# Altium schematic sheet simp_sensor_v1.SchDoc
size A4
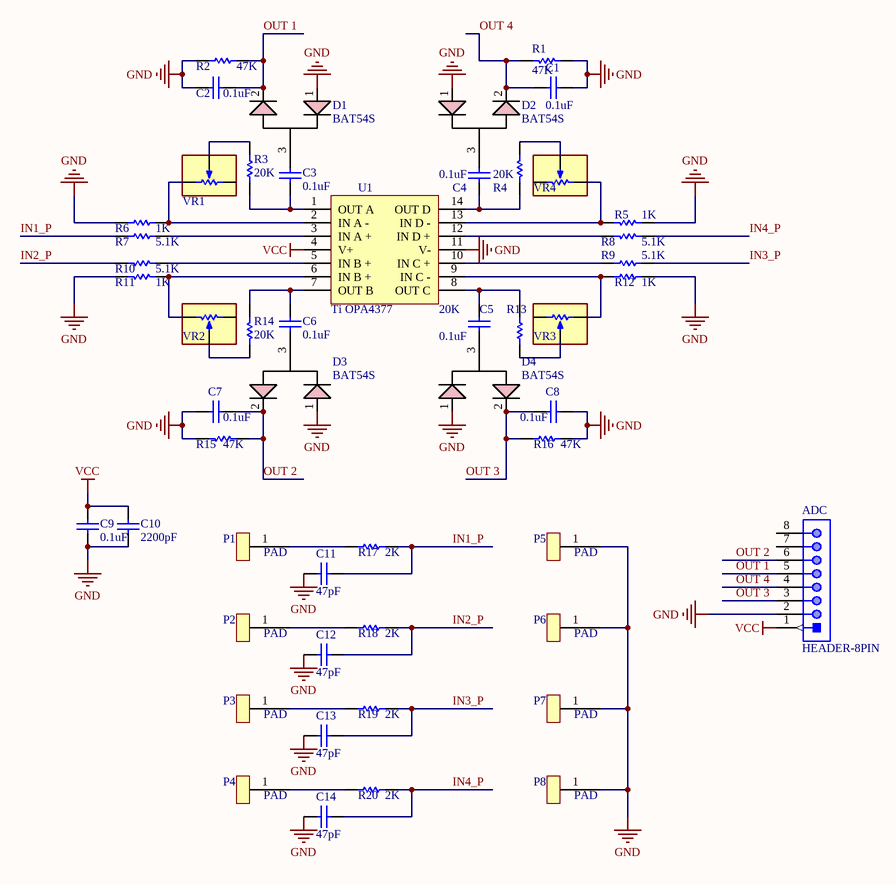
[diagram p0: simp_sensor_v1.SchDoc]

## Parts
ADC  HEADER-8PIN  [HEADER_8P_1.25_RT]
C1  0.1uF  [0603_C]
C2  0.1uF  [0603_C]
C3  0.1uF  [0603_C]
C4  0.1uF  [0603_C]
C5  0.1uF  [0603_C]
C6  0.1uF  [0603_C]
C7  0.1uF  [0603_C]
C8  0.1uF  [0603_C]
C9  0.1uF  [0603_C]
C10  2200pF  [0603_C]
C11  47pF  [0603_C]
C12  47pF  [0603_C]
C13  47pF  [0603_C]
C14  47pF  [0603_C]
D1  BAT54S  [SOT95P240X120-3N]
D2  BAT54S  [SOT95P240X120-3N]
D3  BAT54S  [SOT95P240X120-3N]
D4  BAT54S  [SOT95P240X120-3N]
P1  PAD  [PAD]
P2  PAD  [PAD]
P3  PAD  [PAD]
P4  PAD  [PAD]
P5  PAD  [PAD]
P6  PAD  [PAD]
P7  PAD  [PAD]
P8  PAD  [PAD]
R1  47K  [0603_R]
R2  47K  [0603_R]
R3  20K  [0603_R]
R4  20K  [0603_R]
R5  1K  [0603_R]
R6  1K  [0603_R]
R7  5.1K  [0603_R]
R8  5.1K  [0603_R]
R9  5.1K  [0603_R]
R10  5.1K  [0603_R]
R11  1K  [0603_R]
R12  1K  [0603_R]
R13  20K  [0603_R]
R14  20K  [0603_R]
R15  47K  [0603_R]
R16  47K  [0603_R]
R17  2K  [0603_R]
R18  2K  [0603_R]
R19  2K  [0603_R]
R20  2K  [0603_R]
U1  Ti OPA4377  [TSSOP14]
VR1  3224W-1-101G  [3224W1101G]  (value not drawn)
VR2  3224W-1-101G  [3224W1101G]  (value not drawn)
VR3  3224W-1-101G  [3224W1101G]  (value not drawn)
VR4  3224W-1-101G  [3224W1101G]  (value not drawn)

## Nets
GND: ADC.2 C1.2 C2.2 C7.2 C8.2 C9.1 C10.1 C11.1 C12.1 C13.1 C14.1 D1.1(A) D2.1(A) D3.1(A) D4.1(A) P5.1 P6.1 P7.1 P8.1 R1.1 R2.1 R5.1 R6.1 R11.1 R12.1 R15.1 R16.1 U1.11(V-)
VCC: ADC.1 C9.2 C10.2 U1.4(V+)
IN1_P: C11.2 R7.1 R17.1
IN2_P: C12.2 R10.1 R18.1
IN3_P: C13.2 R9.1 R19.1
IN4_P: C14.2 R8.1 R20.1
OUT 1: ADC.5 C2.1 D1.2(K) R2.2
OUT 2: ADC.6 C7.1 D3.2(K) R15.2
OUT 3: ADC.3 C8.1 D4.2(K) R16.2
OUT 4: ADC.4 C1.1 D2.2(K) R1.2
NetC3_1: C3.1 D1.3(A/K)
NetC3_2: C3.2 R3.2 U1.1(OUT_A)
NetC4_1: C4.1 D2.3(A/K)
NetC4_2: C4.2 R4.2 U1.14(OUT_D)
NetC5_1: C5.1 D4.3(A/K)
NetC5_2: C5.2 R13.2 U1.8(OUT_C)
NetC6_1: C6.1 D3.3(A/K)
NetC6_2: C6.2 R14.2 U1.7(OUT_B)
NetP1_1: P1.1 R17.2
NetP2_1: P2.1 R18.2
NetP3_1: P3.1 R19.2
NetP4_1: P4.1 R20.2
NetR3_1: R3.1 VR1.2(TAP)
NetR4_1: R4.1 VR4.2(TAP)
NetR5_2: R5.2 U1.13(IN_D_-) VR4.3(BOT)
NetR6_2: R6.2 U1.2(IN_A_-) VR1.3(BOT)
NetR7_2: R7.2 U1.3(IN_A_+)
NetR8_2: R8.2 U1.12(IN_D_+)
NetR9_2: R9.2 U1.10(IN_C_+)
NetR10_2: R10.2 U1.5(IN_B_+)
NetR11_2: R11.2 U1.6(IN_B_+) VR2.3(BOT)
NetR12_2: R12.2 U1.9(IN_C_-) VR3.3(BOT)
NetR13_1: R13.1 VR3.2(TAP)
NetR14_1: R14.1 VR2.2(TAP)

Not connected (* = marked no-connect by the designer): ADC 7 8; VR1 1(TOP); VR2 1(TOP); VR3 1(TOP); VR4 1(TOP)

## Library data of the parts
C1-C14 = CAP: Capacitor; Value: 104; Published: 8-Jun-2000; LatestRevisionDate: 17-Jul-2002; LatestRevisionNote: Re-released for DXP Platform.; PackageReference: RAD-0.3; Publisher: Altium Limited
D1-D4 = BAT54S: Schottky Diode; Manufacturer_Name: ON Semiconductor; Datasheet Link: http://www.onsemi.com/pub/Collateral/BAT54S-D.pdf; Height: 1.2mm; Manufacturer_Part_Number: BAT54S; Mouser Part Number: 512-BAT54S; Mouser Price/Stock: https://www.mouser.com/Search/Refine.aspx?Keyword=512-BAT54S; RS Part Number: 6708797P; RS Price/Stock: http://uk.rs-online.com/web/p/products/6708797P
R1-R4 R7-R10 R13-R20 = RES0: Resistor; Value: 1K; Published: 8-Jun-2000; Revision: July-2002: Re-released for DXP Platform.; Publisher: Altium Limited
R5 R6 R11 R12 = RES0: Resistor; Published: 8-Jun-2000; Revision: July-2002: Re-released for DXP Platform.; Publisher: Altium Limited; Value: 1K
U1 = opa4377
VR1-VR4 = 3224W-1-101G: Variable Resistor; Manufacturer_Name: Bourns; Datasheet Link: https://componentsearchengine.com/Datasheets/1/3224W-1-101G.pdf; Height: 5.55mm; Manufacturer_Part_Number: 3224W-1-101G; Mouser Part Number: 652-3224W-1-101G; Mouser Price/Stock: https://www.mouser.com/Search/Refine.aspx?Keyword=652-3224W-1-101G